# EAGLE schematic Wrap030 Memory (EAGLE 9.6.2)
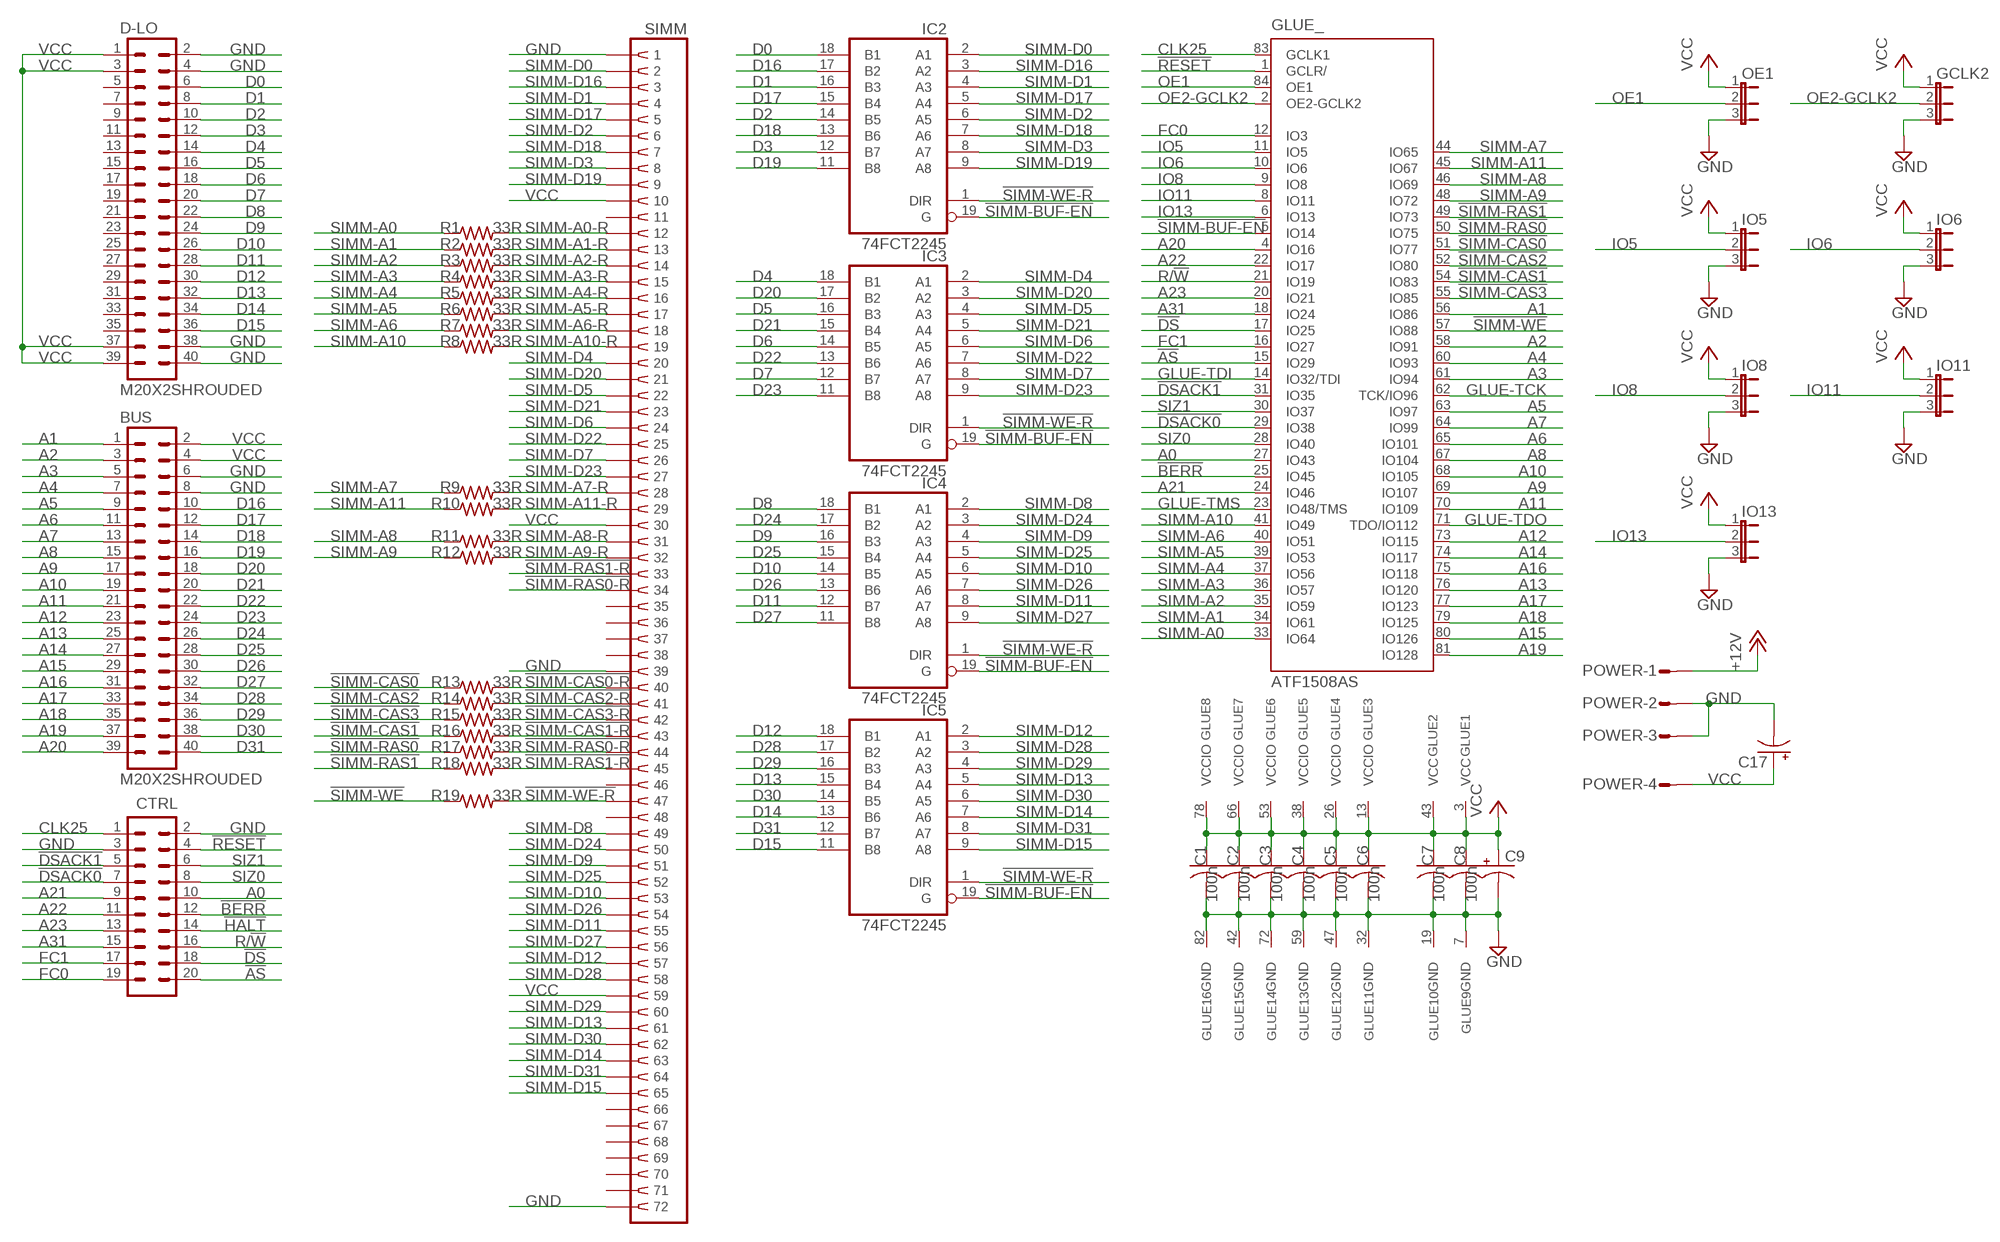
[diagram p0: schematic, sheet 1]

## Parts
BUS  M20X2SHROUDED  [2X20_SHROUDED]
C1  100n  C-USC0805  [C0805]
C2  100n  C-USC0805  [C0805]
C3  100n  C-USC0805  [C0805]
C4  100n  C-USC0805  [C0805]
C5  100n  C-USC0805  [C0805]
C6  100n  C-USC0805  [C0805]
C7  100n  C-USC0805  [C0805]
C8  100n  C-USC0805  [C0805]
C9  CPOL-USE2-5  [E2-5]
C17  CPOL-USE3.5-8  [E3,5-8]
CTRL  M10X2  [2X10]
D-LO  M20X2SHROUDED  [2X20_SHROUDED]
GCLK2  JP2E  [JP2]
GLUE  ATF1508AS  EPM7128-J84S  [S84]
IC2  74FCT2245  74LS245DW  [SO20W]
IC3  74FCT2245  74LS245DW  [SO20W]
IC4  74FCT2245  74LS245DW  [SO20W]
IC5  74FCT2245  74LS245DW  [SO20W]
IO5  JP2E  [JP2]
IO6  JP2E  [JP2]
IO8  JP2E  [JP2]
IO11  JP2E  [JP2]
IO13  JP2E  [JP2]
OE1  JP2E  [JP2]
POWER  L04P  [L04P]
R1  33R  R-US_R0805  [R0805]
R2  33R  R-US_R0805  [R0805]
R3  33R  R-US_R0805  [R0805]
R4  33R  R-US_R0805  [R0805]
R5  33R  R-US_R0805  [R0805]
R6  33R  R-US_R0805  [R0805]
R7  33R  R-US_R0805  [R0805]
R8  33R  R-US_R0805  [R0805]
R9  33R  R-US_R0805  [R0805]
R10  33R  R-US_R0805  [R0805]
R11  33R  R-US_R0805  [R0805]
R12  33R  R-US_R0805  [R0805]
R13  33R  R-US_R0805  [R0805]
R14  33R  R-US_R0805  [R0805]
R15  33R  R-US_R0805  [R0805]
R16  33R  R-US_R0805  [R0805]
R17  33R  R-US_R0805  [R0805]
R18  33R  R-US_R0805  [R0805]
R19  33R  R-US_R0805  [R0805]
SIMM  SIMM72  [73826962]

## Nets
!AS: CTRL.20 GLUE.15(_:IO29)
!BERR: CTRL.12 GLUE.25(_:IO45)
!DS: CTRL.18 GLUE.17(_:IO25)
!DSACK0: CTRL.7 GLUE.29(_:IO38)
!DSACK1: CTRL.5 GLUE.31(_:IO35)
!HALT: CTRL.14
!RESET: CTRL.4 GLUE.1(_:GCLR/)
!SIMM-BUF-EN: GLUE.5(_:IO14) IC2.19(G) IC3.19(G) IC4.19(G) IC5.19(G)
!SIMM-CAS0: GLUE.51(_:IO77) R13.1
!SIMM-CAS0-R: R13.2 SIMM.40
!SIMM-CAS1: GLUE.54(_:IO83) R16.1
!SIMM-CAS1-R: R16.2 SIMM.43
!SIMM-CAS2: GLUE.52(_:IO80) R14.1
!SIMM-CAS2-R: R14.2 SIMM.41
!SIMM-CAS3: GLUE.55(_:IO85) R15.1
!SIMM-CAS3-R: R15.2 SIMM.42
!SIMM-RAS0: GLUE.50(_:IO75) R17.1
!SIMM-RAS0-R: R17.2 SIMM.34 SIMM.44
!SIMM-RAS1: GLUE.49(_:IO73) R18.1
!SIMM-RAS1-R: R18.2 SIMM.33 SIMM.45
!SIMM-WE: GLUE.57(_:IO88) R19.1
!SIMM-WE-R: IC2.1(DIR) IC3.1(DIR) IC4.1(DIR) IC5.1(DIR) R19.2 SIMM.47
+12V: POWER.1
A0: CTRL.10 GLUE.27(_:IO43)
A1: BUS.1 GLUE.56(_:IO86)
A2: BUS.3 GLUE.58(_:IO91)
A3: BUS.5 GLUE.61(_:IO94)
A4: BUS.7 GLUE.60(_:IO93)
A5: BUS.9 GLUE.63(_:IO97)
A6: BUS.11 GLUE.65(_:IO101)
A7: BUS.13 GLUE.64(_:IO99)
A8: BUS.15 GLUE.67(_:IO104)
A9: BUS.17 GLUE.69(_:IO107)
A10: BUS.19 GLUE.68(_:IO105)
A11: BUS.21 GLUE.70(_:IO109)
A12: BUS.23 GLUE.73(_:IO115)
A13: BUS.25 GLUE.76(_:IO120)
A14: BUS.27 GLUE.74(_:IO117)
A15: BUS.29 GLUE.80(_:IO126)
A16: BUS.31 GLUE.75(_:IO118)
A17: BUS.33 GLUE.77(_:IO123)
A18: BUS.35 GLUE.79(_:IO125)
A19: BUS.37 GLUE.81(_:IO128)
A20: BUS.39 GLUE.4(_:IO16)
A21: CTRL.9 GLUE.24(_:IO46)
A22: CTRL.11 GLUE.22(_:IO17)
A23: CTRL.13 GLUE.20(_:IO21)
A31: CTRL.15 GLUE.18(_:IO24)
CLK25: CTRL.1 GLUE.83(_:GCLK1)
D0: D-LO.6 IC2.18(B1)
D1: D-LO.8 IC2.16(B3)
D2: D-LO.10 IC2.14(B5)
D3: D-LO.12 IC2.12(B7)
D4: D-LO.14 IC3.18(B1)
D5: D-LO.16 IC3.16(B3)
D6: D-LO.18 IC3.14(B5)
D7: D-LO.20 IC3.12(B7)
D8: D-LO.22 IC4.18(B1)
D9: D-LO.24 IC4.16(B3)
D10: D-LO.26 IC4.14(B5)
D11: D-LO.28 IC4.12(B7)
D12: D-LO.30 IC5.18(B1)
D13: D-LO.32 IC5.15(B4)
D14: D-LO.34 IC5.13(B6)
D15: D-LO.36 IC5.11(B8)
D16: BUS.10 IC2.17(B2)
D17: BUS.12 IC2.15(B4)
D18: BUS.14 IC2.13(B6)
D19: BUS.16 IC2.11(B8)
D20: BUS.18 IC3.17(B2)
D21: BUS.20 IC3.15(B4)
D22: BUS.22 IC3.13(B6)
D23: BUS.24 IC3.11(B8)
D24: BUS.26 IC4.17(B2)
D25: BUS.28 IC4.15(B4)
D26: BUS.30 IC4.13(B6)
D27: BUS.32 IC4.11(B8)
D28: BUS.34 IC5.17(B2)
D29: BUS.36 IC5.16(B3)
D30: BUS.38 IC5.14(B5)
D31: BUS.40 IC5.12(B7)
FC0: CTRL.19 GLUE.12(_:IO3)
FC1: CTRL.17 GLUE.16(_:IO27)
GLUE-TCK: GLUE.62(_:TCK/IO96)
GLUE-TDI: GLUE.14(_:IO32/TDI)
GLUE-TDO: GLUE.71(_:TDO/IO112)
GLUE-TMS: GLUE.23(_:IO48/TMS)
GND: BUS.6 BUS.8 C1.2 C2.2 C3.2 C4.2 C5.2 C6.2 C7.2 C8.2 C9.- C17.- CTRL.2 CTRL.3 D-LO.2 D-LO.4 D-LO.38 D-LO.40 GCLK2.3 GLUE.7(9:GND) GLUE.19(10:GND) GLUE.32(11:GND) GLUE.42(15:GND) GLUE.47(12:GND) GLUE.59(13:GND) GLUE.72(14:GND) GLUE.82(16:GND) IO5.3 IO6.3 IO8.3 IO11.3 IO13.3 OE1.3 POWER.2 POWER.3 SIMM.1 SIMM.39 SIMM.72
IO5: GLUE.11(_:IO5) IO5.2
IO6: GLUE.10(_:IO6) IO6.2
IO8: GLUE.9(_:IO8) IO8.2
IO11: GLUE.8(_:IO11) IO11.2
IO13: GLUE.6(_:IO13) IO13.2
OE1: GLUE.84(_:OE1) OE1.2
OE2-GCLK2: GCLK2.2 GLUE.2(_:OE2-GCLK2)
R/!W: CTRL.16 GLUE.21(_:IO19)
SIMM-A0: GLUE.33(_:IO64) R1.1
SIMM-A0-R: R1.2 SIMM.12
SIMM-A1: GLUE.34(_:IO61) R2.1
SIMM-A1-R: R2.2 SIMM.13
SIMM-A2: GLUE.35(_:IO59) R3.1
SIMM-A2-R: R3.2 SIMM.14
SIMM-A3: GLUE.36(_:IO57) R4.1
SIMM-A3-R: R4.2 SIMM.15
SIMM-A4: GLUE.37(_:IO56) R5.1
SIMM-A4-R: R5.2 SIMM.16
SIMM-A5: GLUE.39(_:IO53) R6.1
SIMM-A5-R: R6.2 SIMM.17
SIMM-A6: GLUE.40(_:IO51) R7.1
SIMM-A6-R: R7.2 SIMM.18
SIMM-A7: GLUE.44(_:IO65) R9.1
SIMM-A7-R: R9.2 SIMM.28
SIMM-A8: GLUE.46(_:IO69) R11.1
SIMM-A8-R: R11.2 SIMM.31
SIMM-A9: GLUE.48(_:IO72) R12.1
SIMM-A9-R: R12.2 SIMM.32
SIMM-A10: GLUE.41(_:IO49) R8.1
SIMM-A10-R: R8.2 SIMM.19
SIMM-A11: GLUE.45(_:IO67) R10.1
SIMM-A11-R: R10.2 SIMM.29
SIMM-D0: IC2.2(A1) SIMM.2
SIMM-D1: IC2.4(A3) SIMM.4
SIMM-D2: IC2.6(A5) SIMM.6
SIMM-D3: IC2.8(A7) SIMM.8
SIMM-D4: IC3.2(A1) SIMM.20
SIMM-D5: IC3.4(A3) SIMM.22
SIMM-D6: IC3.6(A5) SIMM.24
SIMM-D7: IC3.8(A7) SIMM.26
SIMM-D8: IC4.2(A1) SIMM.49
SIMM-D9: IC4.4(A3) SIMM.51
SIMM-D10: IC4.6(A5) SIMM.53
SIMM-D11: IC4.8(A7) SIMM.55
SIMM-D12: IC5.2(A1) SIMM.57
SIMM-D13: IC5.5(A4) SIMM.61
SIMM-D14: IC5.7(A6) SIMM.63
SIMM-D15: IC5.9(A8) SIMM.65
SIMM-D16: IC2.3(A2) SIMM.3
SIMM-D17: IC2.5(A4) SIMM.5
SIMM-D18: IC2.7(A6) SIMM.7
SIMM-D19: IC2.9(A8) SIMM.9
SIMM-D20: IC3.3(A2) SIMM.21
SIMM-D21: IC3.5(A4) SIMM.23
SIMM-D22: IC3.7(A6) SIMM.25
SIMM-D23: IC3.9(A8) SIMM.27
SIMM-D24: IC4.3(A2) SIMM.50
SIMM-D25: IC4.5(A4) SIMM.52
SIMM-D26: IC4.7(A6) SIMM.54
SIMM-D27: IC4.9(A8) SIMM.56
SIMM-D28: IC5.3(A2) SIMM.58
SIMM-D29: IC5.4(A3) SIMM.60
SIMM-D30: IC5.6(A5) SIMM.62
SIMM-D31: IC5.8(A7) SIMM.64
SIZ0: CTRL.8 GLUE.28(_:IO40)
SIZ1: CTRL.6 GLUE.30(_:IO37)
VCC: BUS.2 BUS.4 C1.1 C2.1 C3.1 C4.1 C5.1 C6.1 C7.1 C8.1 C9.+ C17.+ D-LO.1 D-LO.3 D-LO.37 D-LO.39 GCLK2.1 GLUE.3(1:VCC) GLUE.13(3:VCCIO) GLUE.26(4:VCCIO) GLUE.38(5:VCCIO) GLUE.43(2:VCC) GLUE.53(6:VCCIO) GLUE.66(7:VCCIO) GLUE.78(8:VCCIO) IO5.1 IO6.1 IO8.1 IO11.1 IO13.1 OE1.1 POWER.4 SIMM.10 SIMM.30 SIMM.59
Unconnected: D-LO.5 D-LO.7 D-LO.9 D-LO.11 D-LO.13 D-LO.15 D-LO.17 D-LO.19 D-LO.21 D-LO.23 D-LO.25 D-LO.27 D-LO.29 D-LO.31 D-LO.33 D-LO.35 SIMM.11 SIMM.35 SIMM.36 SIMM.37 SIMM.38 SIMM.46 SIMM.48 SIMM.66 SIMM.67 SIMM.68 SIMM.69 SIMM.70 SIMM.71

## Power pins joined to a net without a drawn wire
GND: IC2.10(GND) IC3.10(GND) IC4.10(GND) IC5.10(GND)
VCC: IC2.20(VCC) IC3.20(VCC) IC4.20(VCC) IC5.20(VCC)

## Library data of the parts
BUS D-LO = SparkFun-Connectors:M20X2: 0.1" spaced headers; PROD_ID: CONN-12263
C1-C8 = rcl:C-US: CAPACITOR, American symbol; SPICEPREFIX: C
C9 C17 = rcl:CPOL-US: POLARIZED CAPACITOR, American symbol; SPICEPREFIX: C
CTRL = SparkFun-Connectors:M10X2: This was SPECIALLY designed to be used with our Graphic LCD Backpack. Be sure you want to use this! It is not only staggered on each line of header holes, but IT IS ALSO offset of the center point of the top and bottom lines by 5 mil. This causes the headers to lock into place on the "standard" footprint on the LCD screen. The extra squares on the tdocu layer are there simply to reference other pins (if you were to actually populate a longer header than ten long - this is what we do with the backpacks).
GCLK2 IO5 IO6 IO8 IO11 IO13 OE1 = jumper:JP2E: JUMPER
GLUE = Wrap030_Parts:EPM7128-J84: EPM70128 MAX 7000 family
IC2-IC5 = 74xx-us:74*245: Octal BUS TRANSCEIVER, 3-state
POWER = con-amp-mt:L04P: AMP MT CONNECTOR; OC_FARNELL: unknown; OC_NEWARK: unknown
R1-R19 = rcl:R-US_: RESISTOR, American symbol; SPICEPREFIX: R
SIMM = con-amp:SIMM72: AMP connector